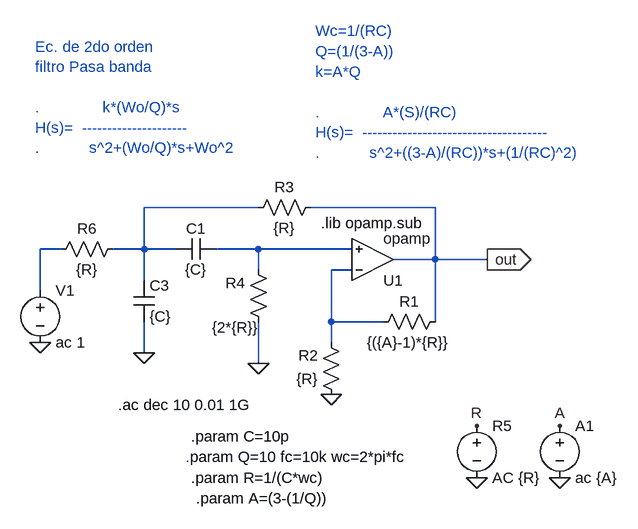
[diagram p0: schematic pasabanda.asc]
pasabanda.asc, the LTspice schematic file:
Version 4
SHEET 1 880 680
WIRE 160 -80 -16 -80
WIRE 432 -80 240 -80
WIRE -144 -16 -176 -16
WIRE -16 -16 -16 -80
WIRE -16 -16 -64 -16
WIRE 32 -16 -16 -16
WIRE 160 -16 96 -16
WIRE 304 -16 160 -16
WIRE 432 0 432 -80
WIRE 432 0 368 0
WIRE 512 0 432 0
WIRE 160 16 160 -16
WIRE 304 16 272 16
WIRE -16 32 -16 -16
WIRE -176 48 -176 -16
WIRE 272 96 272 16
WIRE 352 96 272 96
WIRE 432 96 432 0
WIRE 272 128 272 96
WIRE -16 144 -16 96
WIRE 160 160 160 96
FLAG 160 160 0
FLAG 272 208 0
FLAG -176 128 0
FLAG 512 0 out
IOPIN 512 0 Out
FLAG 624 336 0
FLAG 496 336 0
FLAG 496 256 R
FLAG 624 256 A
FLAG -16 144 0
SYMBOL OpAmps\\opamp 336 64 M180
SYMATTR InstName U1
SYMATTR SpiceLine2 GBW=100Meg
SYMBOL cap 32 0 R270
WINDOW 0 32 32 VTop 2
WINDOW 3 0 32 VBottom 2
SYMATTR InstName C1
SYMATTR Value {C}
SYMBOL res 448 80 R90
WINDOW 0 0 56 VBottom 2
WINDOW 3 32 56 VTop 2
SYMATTR InstName R1
SYMATTR Value {({A}-1)*{R}}
SYMBOL res 288 224 R180
WINDOW 0 36 76 Left 2
WINDOW 3 36 40 Left 2
SYMATTR InstName R2
SYMATTR Value {R}
SYMBOL res 256 -96 R90
WINDOW 0 0 56 VBottom 2
WINDOW 3 32 56 VTop 2
SYMATTR InstName R3
SYMATTR Value {R}
SYMBOL res 176 112 R180
WINDOW 0 36 76 Left 2
WINDOW 3 15 7 Left 2
SYMATTR InstName R4
SYMATTR Value {2*{R}}
SYMBOL voltage -176 32 R0
WINDOW 123 0 0 Left 0
WINDOW 39 0 0 Left 0
SYMATTR InstName V1
SYMATTR Value ac 1
SYMBOL voltage 496 240 R0
SYMATTR InstName R5
SYMATTR Value AC {R}
SYMBOL voltage 624 240 R0
WINDOW 123 0 0 Left 0
WINDOW 39 0 0 Left 0
SYMATTR InstName A1
SYMATTR Value ac {A}
SYMBOL cap -32 32 R0
SYMATTR InstName C3
SYMATTR Value {C}
SYMBOL res -48 -32 R90
WINDOW 0 0 56 VBottom 2
WINDOW 3 32 56 VTop 2
SYMATTR InstName R6
SYMATTR Value {R}
TEXT 256 -56 Left 2 !.lib opamp.sub
TEXT 248 -352 Left 2 ;Wc=1/(RC)\nQ=(1/(3-A))\nk=A*Q\n \n.              A*(S)/(RC)\nH(s)=  -------------------------------------\n.           s^2+((3-A)/(RC))*s+(1/(RC)^2)
TEXT -184 -328 Left 2 ;Ec. de 2do orden \nfiltro Pasa banda\n \n.              k*(Wo/Q)*s\nH(s)=  ---------------------\n.           s^2+(Wo/Q)*s+Wo^2
TEXT 56 272 Left 2 !.param C=10p
TEXT 48 304 Left 2 !.param Q=10 fc=10k wc=2*pi*fc
TEXT 56 336 Left 2 !.param R=1/(C*wc)
TEXT 64 368 Left 2 !.param A=(3-(1/Q))
TEXT -56 224 Left 2 !.ac dec 10 0.01 1G

The netlist it stands for:
* pasabanda.asc
XU1 N004 N003 out opamp Aol=100K GBW=100Meg  ; pins invin noninvin out
C1 N001 N003 {C}
R1 out N004 {({A}-1)*{R}}
R2 0 N004 {R}
R3 out N001 {R}
R4 0 N003 {2*{R}}
V1 N002 0 ac 1
V§R5 R 0 AC {R}
V§A1 A 0 ac {A}
C3 N001 0 {C}
R6 N001 N002 {R}
.lib opamp.sub
* Wc=1/(RC)
* Q=(1/(3-A))
* k=A*Q
* .              A*(S)/(RC)
* H(s)=  -------------------------------------
* .           s^2+((3-A)/(RC))*s+(1/(RC)^2)
* Ec. de 2do orden
* filtro Pasa banda
* .              k*(Wo/Q)*s
* H(s)=  ---------------------
* .           s^2+(Wo/Q)*s+Wo^2
.param C=10p
.param Q=10 fc=10k wc=2*pi*fc
.param R=1/(C*wc)
.param A=(3-(1/Q))
.ac dec 10 0.01 1G
.backanno
.end